# Altium schematic sheet lcd.SchDoc
size A4
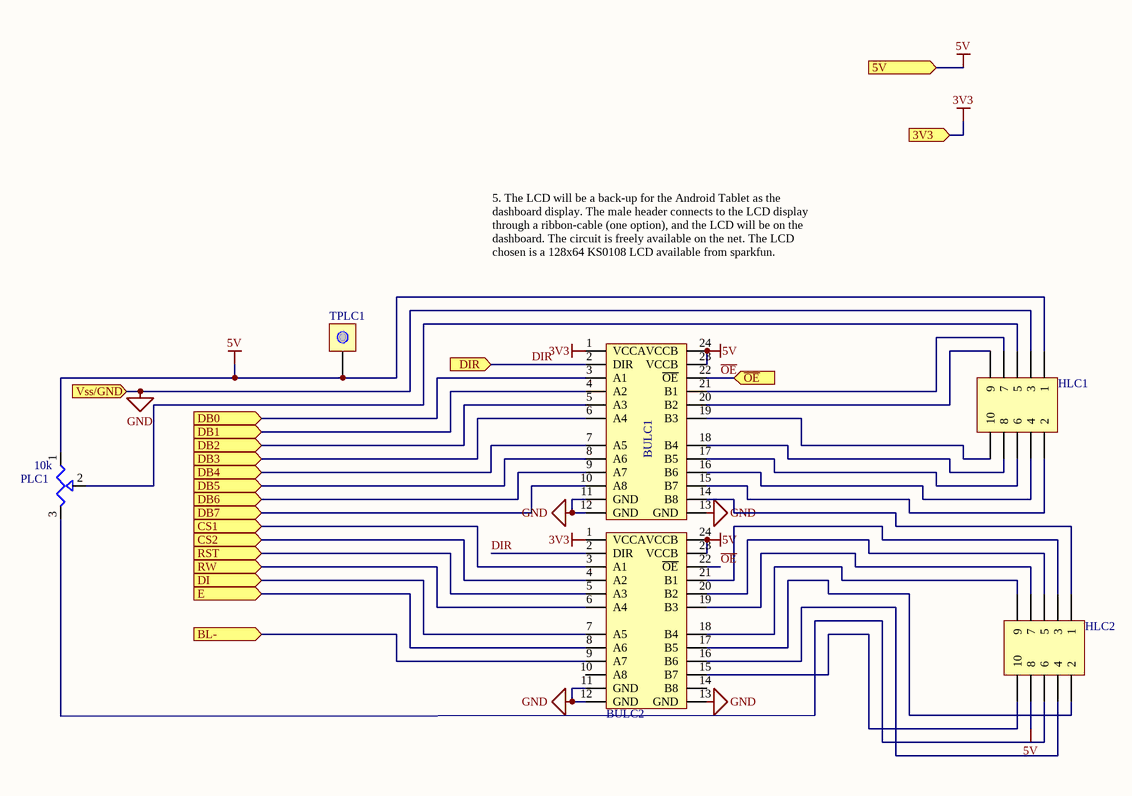
[diagram p0: lcd.SchDoc]

## Parts
BULC1  BUS TRANSCEIVER  [TSSOP24]  (value not drawn)
BULC2  BUS TRANSCEIVER  [TSSOP24]  (value not drawn)
HLC1  Header 5X2H  [HDR2X5H]  (value not drawn)
HLC2  Header 5X2H  [HDR2X5H]  (value not drawn)
PLC1  value 10k  [TC33]  (hidden comment: Trimmer)
TPLC1  TEST  [TESTPOINT]  (value not drawn)

## Ports
3V3 (in), 5V (in), BL- (in), CS1 (in), CS2 (in), DB0 (in), DB1 (in), DB2 (in), DB3 (in), DB4 (in), DB5 (in), DB6 (in), DB7 (in), DI (in), DIR (in), E (in), RST (in), RW (in), Vss/GND (in), ~{OE} (in)

## Nets
3V3: BULC1.1(VCCA) BULC2.1(VCCA) ; port 3V3
5V: BULC1.23(VCCB) BULC1.24(VCCB) BULC2.23(VCCB) BULC2.24(VCCB) HLC1.1 HLC2.8 PLC1.1(CCW) TPLC1.0(TP) ; port 5V
GND: BULC1.11(GND) BULC1.12(GND) BULC1.13(GND) BULC2.11(GND) BULC2.12(GND) BULC2.13(GND) HLC1.3 ; port Vss/GND
~{OE}: BULC1.22(~{OE}) BULC2.22(~{OE}) ; port ~{OE}
BL-: BULC2.9(A7) ; port BL-
CS1: BULC2.3(A1) ; port CS1
CS2: BULC2.4(A2) ; port CS2
DB0: BULC1.3(A1) ; port DB0
DB1: BULC1.4(A2) ; port DB1
DB2: BULC1.5(A3) ; port DB2
DB3: BULC1.6(A4) ; port DB3
DB4: BULC1.7(A5) ; port DB4
DB5: BULC1.8(A6) ; port DB5
DB6: BULC1.9(A7) ; port DB6
DB7: BULC1.10(A8) ; port DB7
DI: BULC2.7(A5) ; port DI
DIR: BULC1.2(DIR) BULC2.2(DIR) ; port DIR
E: BULC2.8(A6) ; port E
RST: BULC2.5(A3) ; port RST
RW: BULC2.6(A4) ; port RW
NetBULC1_14: BULC1.14(B8) HLC2.1
NetBULC1_15: BULC1.15(B7) HLC1.2
NetBULC1_16: BULC1.16(B6) HLC1.4
NetBULC1_17: BULC1.17(B5) HLC1.6
NetBULC1_18: BULC1.18(B4) HLC1.8
NetBULC1_19: BULC1.19(B3) HLC1.10
NetBULC1_20: BULC1.20(B2) HLC1.9
NetBULC1_21: BULC1.21(B1) HLC1.7
NetBULC2_15: BULC2.15(B7) HLC2.10
NetBULC2_16: BULC2.16(B6) HLC2.4
NetBULC2_17: BULC2.17(B5) HLC2.2
NetBULC2_18: BULC2.18(B4) HLC2.9
NetBULC2_19: BULC2.19(B3) HLC2.7
NetBULC2_20: BULC2.20(B2) HLC2.5
NetBULC2_21: BULC2.21(B1) HLC2.3
NetHLC1_5: HLC1.5 PLC1.2(WIPER)
NetHLC2_6: HLC2.6 PLC1.3(CW)

Not connected (* = marked no-connect by the designer): BULC2 10(A8) 14(B8)

## Notes on the sheet
- 5. The LCD will be a back-up for the Android Tablet as the dashboard display. The male header connects to the LCD display through a ribbon-cable (one option), and the LCD will be on the dashboard. The circuit is freely available on the net. The LCD chosen is a 128x64 KS0108 LCD available from sparkfun.

## Library data of the parts
BULC1 BULC2 = SN74LVC8T245: 8-BIT DUAL-SUPPLY BUS TRANSCEIVER WITH CONFIGURABLE VOLTAGE TRANSLATION AND 3-STATE OUTPUTS
HLC1 HLC2 = Header 5X2H: Header, 5-Pin, Dual row, Right Angle; LatestRevisionDate: 17-Jul-2002; LatestRevisionNote: Re-released for DXP Platform.; Publisher: Altium Limited
PLC1 = TC33: 3mm SMD Trimming Pot; Manufacturer: Bourns
TPLC1 = TEST: TEST POINT